# EAGLE board MAIN_BQ_INDUCTOR_REV (EAGLE 9.6.2), part 1 of 2
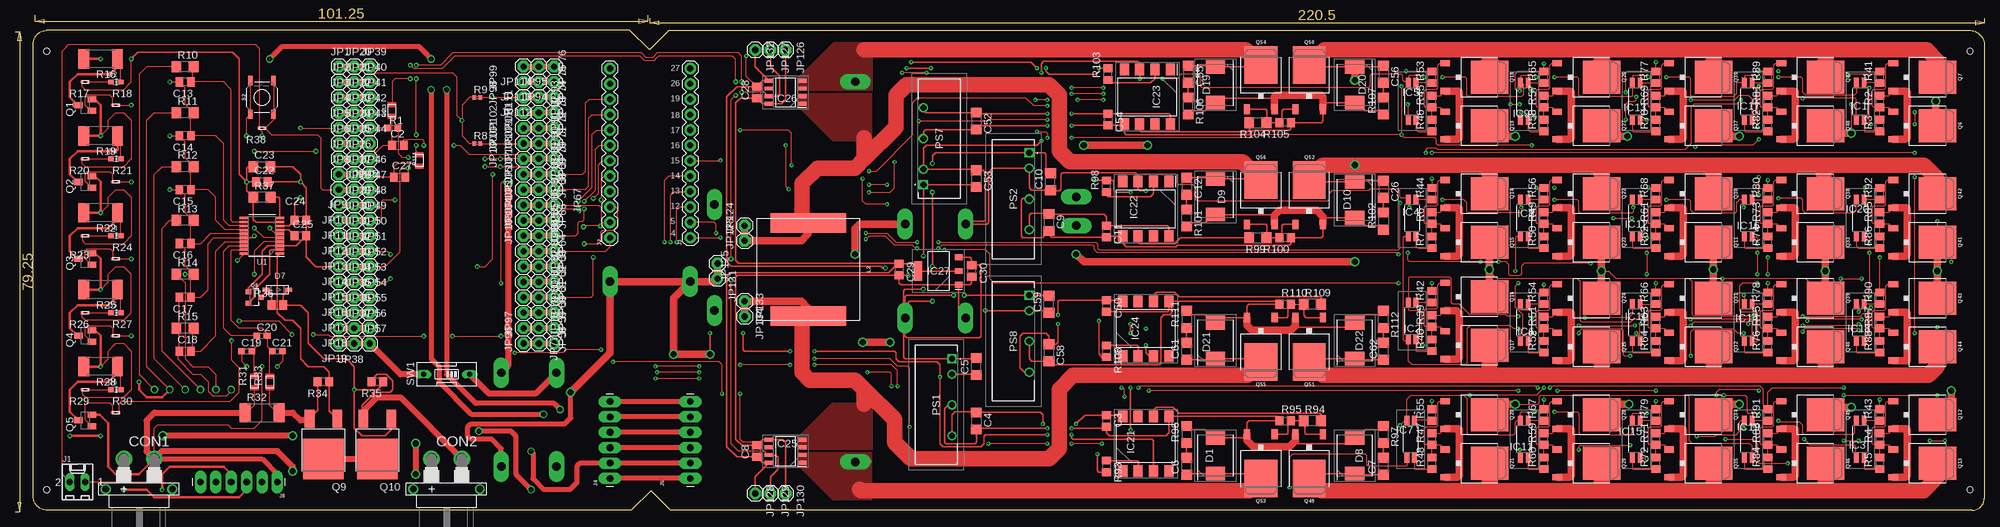
[diagram p2: board, top side]
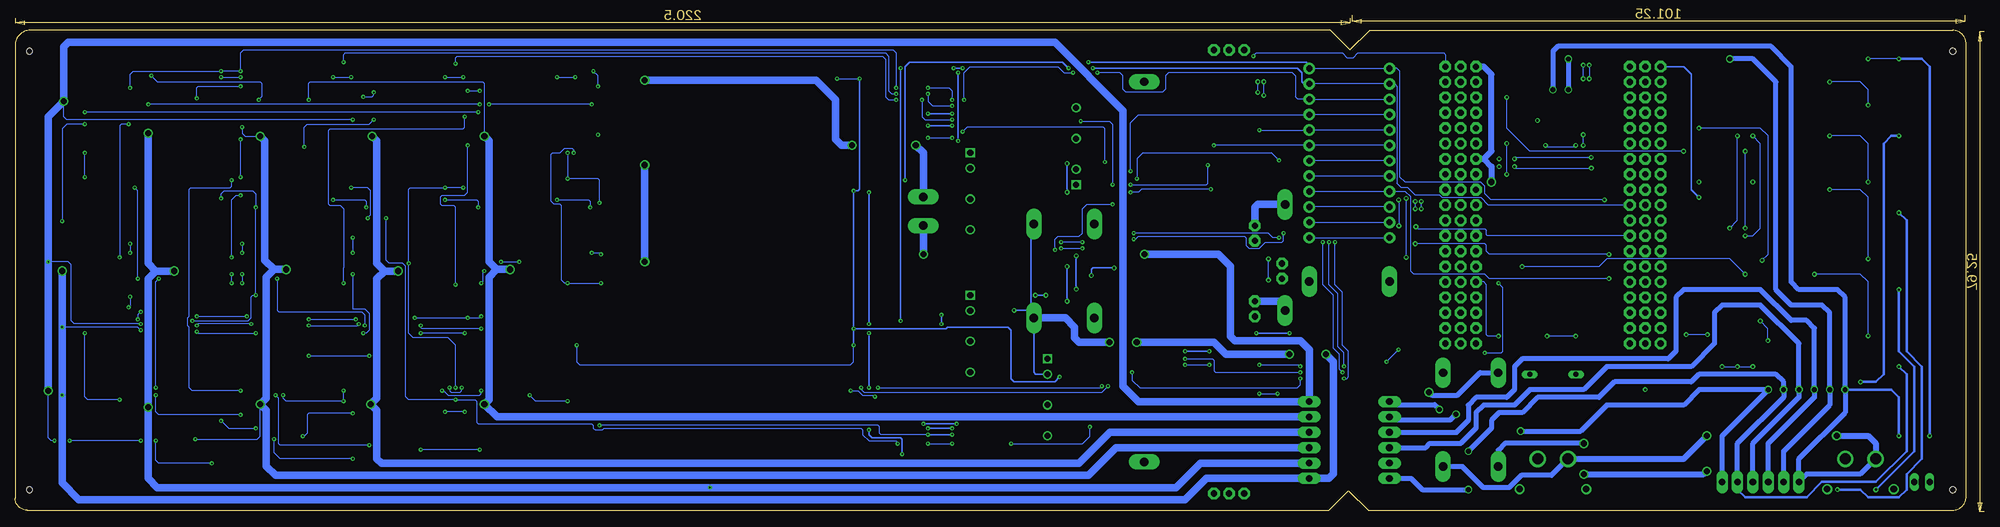
[diagram p3: board, bottom side, seen from below]

Size 322.25 x 79.25 mm. Coordinates in mm from the lower left corner, seen from the top.
Outline: 320.25,0 105.25,0 102,3.25 98.75,0 2.25,0 arc-90 0,2.25 0,77 arc-90 2.25,79.25 98.5,79.25 101.75,76 105,79.25 319.75,79.25 arc-84 322.25,77 322.25,2 arc-90 320.25,0
Copper layers (1*16): Top 0.035mm / dielectric 1.5mm / Bottom 0.035mm
Design rules "default *": minimum track width 6mil, minimum drill 0.25mm, track to track 6mil, track to pad 6mil, pad to pad 6mil, via to via 6mil, smd to smd 6mil, copper to edge 40mil, drill to drill 6mil, minimum pad ring 10mil, minimum via ring 8mil, stop-mask expansion 4mil, vias tented up to drill 0mil, thermal gap 10mil
Holes 1 mm at 319.87,75.79 319.87,3.4 2.22,3.4 2.22,75.79

## Footprints (pad centres in the part's own frame; a part is rotated, then mirrored left to right if it is on the bottom)
C0805 = smd 1.3 x 1.5: 1 -0.95,0; 2 0.95,0
C1206 = smd 1.6 x 1.8: 1 -1.4,0; 2 1.4,0
C0603 = smd 1.1 x 1: 1 -0.85,0; 2 0.85,0
XT30PW-F = drill 1.8: + 2.5,0; - -2.5,0 | drill 1.1: P$3 -5.5,5; P$4 5.5,5
DIOM6959X262N = smd 2.25 x 3.15: 1 -2.95,0; 2 2.95,0
LED_CHIP-LED0603MP = smd 0.8 x 0.9: A 0,-0.794; C 0,0.794
SOD-123 = smd 1.2 x 0.7: A 1.85,0; C -1.85,0
LTV217G = smd 0.8 x 1.5: 1 -0.635,-3.125; 2 0.635,-3.125; 3 0.635,3.125; 4 -0.635,3.125
SOP254P1000X400-8N = smd 1.9 x 1.5: 1 -4.5,3.81; 2 -4.5,1.27; 3 -4.5,-1.27; 4 -4.5,-3.81; 5 4.5,-3.81; 6 4.5,-1.27; 7 4.5,1.27; 8 4.5,3.81
SOIC127P600X175-8N = smd 1.528 x 0.65: 1 -2.711,1.905; 2 -2.711,0.635; 3 -2.711,-0.635; 4 -2.711,-1.905; 5 2.711,-1.905; 6 2.711,-0.635; 7 2.711,0.635; 8 2.711,1.905
SOT229P700X180-4N = smd 1.3 x 0.95: 1 -3.35,2.29; 2 -3.35,0; 3 -3.35,-2.29 | smd 1.3 x 3.25: 4 3.35,0
6410-02 = drill 1.016 long: 1 1.27,0; 2 -1.27,0
1X12 = drill 1.016 pad 1.88: 1 0,0; 2 2.54,0; 3 5.08,0; 4 7.62,0; 5 10.16,0; 6 12.7,0; 7 15.24,0; 8 17.78,0; 9 20.32,0; 10 22.86,0; 11 25.4,0; 12 27.94,0
1X06_LONGPADS = drill 1.118 pad 1.88 long: 1 0,0; 2 2.54,0; 3 5.08,0; 4 7.62,0; 5 10.16,0; 6 12.7,0
1X01 = drill 1.016 pad 1.93 octagon: 1 0,0
1X1-BIGPOGO = drill 1.4 pad 2.54 long: P$1 0,0
PA4344-17X17 = smd 12.5 x 3.15: 1 0,7.675; 2 0,-7.675
B1212S2WR3 = drill 1 pad 1.5 square: 1 0,0 | drill 1 pad 1.5: 2 2.54,0; 4 7.62,0; 6 12.7,0
SOT23 = smd 1 x 1.4: 1 -0.95,-1.1; 2 0.95,-1.1; 3 0,1.1
TO252 = smd 5.4 x 6.2: D 0,2.5 | smd 1 x 1.6: G -2.28,-4.8; S 2.28,-4.8
SOT23-3 = smd 0.8 x 0.9: 1 -0.95,-1; 2 0.95,-1; 3 0,1.1
DPAK = smd 1.6 x 3: 1 -2.3,-6.65; 3 2.3,-6.65 | smd 6.7 x 6.7: 2 0,0
R0603 = smd 1 x 1.1: 1 -0.85,0; 2 0.85,0
R0805 = smd 1.3 x 1.5: 1 -0.95,0; 2 0.95,0
R0402 = smd 0.6 x 0.7: 1 -0.5,0; 2 0.5,0
R1206 = smd 1.6 x 1.803: 1 -1.422,0; 2 1.422,0
R2512 = smd 1.8 x 3.2: 1 -2.8,0; 2 2.8,0
R0402' = smd 0.2 x 0.2: 1 -0.5,0; 2 0.5,0
R0805' = smd 0.2 x 0.2: 1 -1,0; 2 1,0
TACTILE_SWITCH_SMD_5.2MM = smd 1.524 x 0.762: 1 -2.794,1.905; 2 2.794,1.905; 3 -2.794,-1.905; 4 2.794,-1.905
EDG-01 = drill 0.813 long: 1 0,-3.81; 2 0,3.81
TSSOP-20_4.4X6.5MM_PITCH0.65MM = smd 1.45 x 0.45: 1 -2.95,2.925; 2 -2.95,2.275; 3 -2.95,1.625; 4 -2.95,0.975; 5 -2.95,0.325; 6 -2.95,-0.325; 7 -2.95,-0.975; 8 -2.95,-1.625; 9 -2.95,-2.275; 10 -2.95,-2.925; 11 2.95,-2.925; 12 2.95,-2.275; 13 2.95,-1.625; 14 2.95,-0.975; 15 2.95,-0.325; 16 2.95,0.325; 17 2.95,0.975; 18 2.95,1.625; 19 2.95,2.275; 20 2.95,2.925

## Placement (x,y rotation side)
C2  1n  [C0805]  60.25,60.25 0 top
C3  100nF  [C0805]  177.25,14.75 270 top
C4  1uF  [C1206]  155.75,14.75 270 top
C5  4.7uF  [C1206]  155.75,23.75 90 top
C6  EMPTY  [C1206]  190.5,7.25 90 top
C7  EMPTY  [C1206]  223,7.25 90 top
C8  100n  [C0805]  119.5,9.75 90 top
C9  1uF  [C1206]  167.75,47.5 270 top
C10  4.7uF  [C1206]  168,54.25 90 top
C11  100nF  [C0805]  177.25,46 270 top
C12  EMPTY  [C1206]  190.5,53.5 270 top
C13  16V, 1uF  [C0805]  25.08,70.71 180 top
C14  16V, 1uF  [C0805]  25.08,61.82 180 top
C15  16V, 1uF  [C0805]  25.08,52.93 180 top
C16  16V, 1uF  [C0805]  25.08,44.04 180 top
C17  16V, 1uF  [C0805]  25.08,35.15 180 top
C18  16V, 1uF  [C0805]  25.08,26.26 0 top
C19  50V, 0.1uF  [C0603]  35.24,26.26 0 top
C20  50V, 0.1uF  [C0603]  37.78,28.8 0 top
C21  50V, 0.1uF  [C0603]  40.32,26.26 0 top
C22  1uF  [C0805]  37.78,54.2 0 top
C23  10uF  [C1206]  37.78,56.74 0 top
C24  4.7uF  [C0805]  44.13,47.85 0 top
C25  1uF  [C0805]  44.13,45.31 0 top
C26  EMPTY  [C1206]  223,53 270 top
C27  1n  [C0805]  60.5,55 0 top
C28  100n  [C0805]  119.5,69 90 top
C29  22uF  [C0805]  143,39.75 270 top
C30  10uF  [C0805]  155,39.5 270 top
C52  1uF  [C1206]  155.75,64.25 270 top
C53  4.7uF  [C1206]  155.75,54.75 270 top
C54  100nF  [C0805]  177.5,64.5 270 top
C55  EMPTY  [C1206]  190.75,72 270 top
C56  EMPTY  [C1206]  223,72 270 top
C58  1uF  [C1206]  167.75,26 270 top
C59  4.7uF  [C1206]  167.75,34 90 top
C60  100nF  [C0805]  177.25,33.75 270 top
C61  EMPTY  [C1206]  190.5,26.25 90 top
C62  EMPTY  [C1206]  223,26.25 90 top
CON1  XT30PW-F  [XT30PW-F]  17.46,8.48 180 top
CON2  XT30PW-F  [XT30PW-F]  68.26,8.48 180 top
D1  SS34  [DIOM6959X262N]  195.25,9 90 top
D2  KT-0603R  [LED_CHIP-LED0603MP]  13.65,70.71 270 top
D3  KT-0603R  [LED_CHIP-LED0603MP]  13.65,58.01 270 top
D4  KT-0603R  [LED_CHIP-LED0603MP]  13.65,45.31 270 top
D5  KT-0603R  [LED_CHIP-LED0603MP]  13.65,32.61 270 top
D6  KT-0603R  [LED_CHIP-LED0603MP]  13.65,19.91 270 top
D7  1N4148W  [SOD-123]  40.32,36.42 180 top
D8  SS34  [DIOM6959X262N]  218.25,9 90 top
D9  SS34  [DIOM6959X262N]  195.25,51.75 270 top
D10  SS34  [DIOM6959X262N]  218.25,51.25 270 top
D19  SS34  [DIOM6959X262N]  195.25,70.25 270 top
D20  SS34  [DIOM6959X262N]  218.25,70.25 270 top
D21  SS34  [DIOM6959X262N]  195.25,28 90 top
D22  SS34  [DIOM6959X262N]  218.25,28 90 top
IC1  LTV-217-G  [LTV217G]  301.75,67.5 180 top
IC2  LTV-217-G  [LTV217G]  227.75,31.25 180 top
IC3  LTV-217-G  [LTV217G]  301.75,11.75 180 top
IC4  LTV-217-G  [LTV217G]  227.75,48.25 180 top
IC5  LTV-217-G  [LTV217G]  227.75,67.5 180 top
IC6  LTV-217-G  [LTV217G]  246.25,31 180 top
IC7  LTV-217-G  [LTV217G]  227.5,11.75 180 top
IC8  LTV-217-G  [LTV217G]  246.25,48.25 180 top
IC9  LTV-217-G  [LTV217G]  246.25,67.5 180 top
IC10  LTV-217-G  [LTV217G]  264.75,31 180 top
IC11  LTV-217-G  [LTV217G]  246.25,11.75 180 top
IC12  LTV-217-G  [LTV217G]  264.75,48.25 180 top
IC13  LTV-217-G  [LTV217G]  264.75,67.5 180 top
IC14  LTV-217-G  [LTV217G]  283.25,31 180 top
IC15  LTV-217-G  [LTV217G]  264.75,11.75 180 top
IC16  LTV-217-G  [LTV217G]  283.25,48.25 180 top
IC17  LTV-217-G  [LTV217G]  283.25,67.5 180 top
IC18  LTV-217-G  [LTV217G]  301.75,31 180 top
IC19  LTV-217-G  [LTV217G]  283.25,11.75 180 top
IC20  LTV-217-G  [LTV217G]  301.75,48.25 180 top
IC21  FOD3182SD  [SOP254P1000X400-8N]  183.75,11 90 top
IC22  FOD3182SD  [SOP254P1000X400-8N]  183.75,49.75 270 top
IC23  FOD3182SD  [SOP254P1000X400-8N]  184,68.25 270 top
IC24  FOD3182SD  [SOP254P1000X400-8N]  183.75,30 90 top
IC25  TMCS1101A4BQDT  [SOIC127P600X175-8N]  124.25,9.75 180 top
IC26  TMCS1101A4BQDT  [SOIC127P600X175-8N]  124.25,69 180 top
IC27  AMS1117  [SOT229P700X180-4N]  149.5,39.5 180 top
J1  22-27-2021-02  [6410-02]  7.3,4.67 0 top
J2  [1X12]  95.25,45 90 top
J3  [1X12]  108.5,45 90 top
J4  [1X06_LONGPADS]  95.25,5.25 90 top
J5  [1X06_LONGPADS]  108.5,5.25 90 top
J8  [1X06_LONGPADS]  40.32,4.67 180 top
JP1  [1X01]  50.48,73.25 0 top
JP2  [1X01]  50.48,70.71 0 top
JP3  [1X01]  50.48,68.17 0 top
JP4  [1X01]  50.48,65.63 0 top
JP5  [1X01]  50.48,63.09 0 top
JP6  [1X01]  50.48,60.55 0 top
JP7  [1X01]  50.48,58.01 0 top
JP8  [1X01]  50.48,55.47 0 top
JP9  [1X01]  50.48,52.93 180 top
JP10  [1X01]  50.48,50.39 180 top
JP11  [1X01]  50.48,47.85 180 top
JP12  [1X01]  50.48,45.31 180 top
JP13  [1X01]  50.48,42.77 180 top
JP14  [1X01]  50.48,40.23 180 top
JP15  [1X01]  50.48,37.69 180 top
JP16  [1X01]  50.48,35.15 180 top
JP17  [1X01]  50.48,32.61 180 top
JP18  [1X01]  50.48,30.07 180 top
JP19  [1X01]  50.48,27.53 180 top
JP20  [1X01]  53.02,73.25 0 top
JP21  [1X01]  53.02,70.71 0 top
JP22  [1X01]  53.02,68.17 0 top
JP23  [1X01]  53.02,65.63 0 top
JP24  [1X01]  53.02,63.09 0 top
JP25  [1X01]  53.02,60.55 0 top
JP26  [1X01]  53.02,58.01 0 top
JP27  [1X01]  53.02,55.47 0 top
JP28  [1X01]  53.02,52.93 0 top
JP29  [1X01]  53.02,50.39 0 top
JP30  [1X01]  53.02,47.85 0 top
JP31  [1X01]  53.02,45.31 0 top
JP32  [1X01]  53.02,42.77 0 top
JP33  [1X01]  53.02,40.23 0 top
JP34  [1X01]  53.02,37.69 0 top
JP35  [1X01]  53.02,35.15 0 top
JP36  [1X01]  53.02,32.61 0 top
JP37  [1X01]  53.02,30.07 0 top
JP38  [1X01]  53.02,27.53 180 top
JP39  [1X01]  55.56,73.25 0 top
JP40  [1X01]  55.56,70.71 0 top
JP41  [1X01]  55.56,68.17 0 top
JP42  [1X01]  55.56,65.63 0 top
JP43  [1X01]  55.56,63.09 0 top
JP44  [1X01]  55.56,60.55 0 top
JP45  [1X01]  55.56,58.01 180 top
JP46  [1X01]  55.56,55.47 0 top
JP47  [1X01]  55.56,52.93 0 top
JP48  [1X01]  55.56,50.39 0 top
JP49  [1X01]  55.56,47.85 0 top
JP50  [1X01]  55.56,45.31 0 top
JP51  [1X01]  55.56,42.77 0 top
JP52  [1X01]  55.56,40.23 0 top
JP53  [1X01]  55.56,37.69 0 top
JP54  [1X01]  55.56,35.15 0 top
JP55  [1X01]  55.56,32.61 0 top
JP56  [1X01]  55.56,30.07 0 top
JP57  [1X01]  55.56,27.53 0 top
JP58  [1X01]  86.04,27.53 90 top
JP59  [1X01]  86.04,30.07 90 top
JP60  [1X01]  86.04,32.61 90 top
JP61  [1X01]  86.04,35.15 90 top
JP62  [1X01]  86.04,37.69 90 top
JP63  [1X01]  86.04,40.23 90 top
JP64  [1X01]  86.04,42.77 90 top
JP65  [1X01]  86.04,45.31 90 top
JP66  [1X01]  86.04,47.85 90 top
JP67  [1X01]  86.04,50.39 90 top
JP68  [1X01]  86.04,52.93 90 top
JP69  [1X01]  86.04,55.47 90 top
JP70  [1X01]  86.04,58.01 90 top
JP71  [1X01]  86.04,60.55 90 top
JP72  [1X01]  86.04,63.09 90 top
JP73  [1X01]  86.04,65.63 90 top
JP74  [1X01]  86.04,68.17 90 top
JP75  [1X01]  86.04,70.71 90 top
JP76  [1X01]  86.04,73.25 90 top
JP77  [1X01]  83.5,27.53 270 top
JP78  [1X01]  83.5,30.07 90 top
JP79  [1X01]  83.5,32.61 90 top
JP80  [1X01]  83.5,35.15 90 top
JP81  [1X01]  83.5,37.69 90 top
JP82  [1X01]  83.5,40.23 90 top
JP83  [1X01]  83.5,42.77 90 top
JP84  [1X01]  83.5,45.31 90 top
JP85  [1X01]  83.5,47.85 90 top
JP86  [1X01]  83.5,50.39 90 top
JP87  [1X01]  83.5,52.93 90 top
JP88  [1X01]  83.5,55.47 90 top
JP89  [1X01]  83.5,58.01 90 top
JP90  [1X01]  83.5,60.55 90 top
JP91  [1X01]  83.5,63.09 90 top
JP92  [1X01]  83.5,65.63 90 top
JP93  [1X01]  83.5,68.17 90 top
JP94  [1X01]  83.5,70.71 180 top
JP95  [1X01]  83.5,73.25 180 top
JP96  [1X01]  80.96,27.53 90 top
JP97  [1X01]  80.96,30.07 90 top
JP98  [1X01]  80.96,32.61 90 top
JP99  [1X01]  80.96,35.15 90 top
JP100  [1X01]  80.96,37.69 90 top
JP101  [1X01]  80.96,40.23 90 top
JP102  [1X01]  80.96,42.77 90 top
JP103  [1X01]  80.96,45.31 90 top
JP104  [1X01]  80.96,47.85 90 top
JP105  [1X01]  80.96,50.39 90 top
JP106  [1X01]  80.96,52.93 90 top
JP107  [1X01]  80.96,55.47 90 top
JP108  [1X01]  80.96,58.01 90 top
JP109  [1X01]  80.96,60.55 90 top
JP110  [1X01]  80.96,63.09 90 top
JP111  [1X01]  80.96,65.63 90 top
JP112  [1X01]  80.96,68.17 180 top
JP113  [1X01]  80.96,70.71 180 top
JP114  [1X01]  80.96,73.25 180 top
JP115  [1X1-BIGPOGO]  144,47.25 90 top
JP116  [1X1-BIGPOGO]  154,31.75 270 top
JP117  [1X1-BIGPOGO]  144,31.75 270 top
JP118  [1X1-BIGPOGO]  154,47.25 270 top
JP119  [1X1-BIGPOGO]  86.4,7.21 270 top
JP120  [1X1-BIGPOGO]  77.31,22.7 90 top
JP121  [1X1-BIGPOGO]  86.4,22.7 90 top
JP122  [1X1-BIGPOGO]  77.31,7.21 90 top
JP123  [1X01]  117.5,44.5 90 top
JP124  [1X01]  117.5,47 90 top
JP125  [1X01]  113,40.75 270 top
JP126  [1X01]  124.25,76 270 top
JP127  [1X01]  121.75,76 270 top
JP128  [1X01]  119.25,2.75 270 top
JP129  [1X01]  121.75,2.75 270 top
JP130  [1X01]  124.25,2.75 270 top
JP131  [1X01]  113,38.25 270 top
JP132  [1X01]  119.25,76 270 top
JP133  [1X01]  117.5,34.5 270 top
JP134  [1X01]  117.5,32 270 top
JP135  [1X1-BIGPOGO]  95.25,37.75 270 top
JP136  [1X1-BIGPOGO]  108.5,37.75 90 top
JP137  [1X1-BIGPOGO]  135.75,8 0 top
JP138  [1X1-BIGPOGO]  112.5,33 90 top
JP139  [1X1-BIGPOGO]  112.5,50.5 270 top
JP140  [1X1-BIGPOGO]  135.75,70.75 180 top
JP141  [1X1-BIGPOGO]  172.25,47 0 top
JP142  [1X1-BIGPOGO]  172.25,51.75 0 bottom
L2  SMMS1770-470M  [PA4344-17X17]  128,39.75 180 top
PS1  B0515S-2WR3  [B1212S2WR3]  151.75,25 270 top
PS2  B0515S-2WR3  [B1212S2WR3]  164.5,59 270 top
PS7  B0515S-2WR3  [B1212S2WR3]  147,53.75 90 top
PS8  B0515S-2WR3  [B1212S2WR3]  164.5,35.5 270 top
Q1  AO3400A  [SOT23]  8.57,66.9 90 top
Q2  AO3400A  [SOT23]  8.57,54.2 90 top
Q3  AO3400A  [SOT23]  8.57,41.5 90 top
Q4  AO3400A  [SOT23]  8.57,28.8 90 top
Q5  AO3400A  [SOT23]  8.57,14.83 90 top
Q6  HSU4119  [TO252]  312,63.5 270 top
Q7  HSU4119  [TO252]  312,71.5 270 top
Q8  20V/4.2A/52mΩ/1.4W  [SOT23-3]  36.51,35.15 270 top
Q9  DOD120N04  [DPAK]  47.94,8.48 180 top
Q10  DOD120N04  [DPAK]  56.83,8.48 180 top
Q11  DOD120N04  [TO252]  275,44.25 270 top
Q12  HSU4119  [TO252]  312,15.75 270 top
Q13  HSU4119  [TO252]  312,7.75 270 top
Q14  HSU4119  [TO252]  238,52.25 270 top
Q15  HSU4119  [TO252]  238,44.25 270 top
Q16  HSU4119  [TO252]  238,35.25 270 top
Q17  HSU4119  [TO252]  238,27.25 270 top
Q18  HSU4119  [TO252]  238,71.5 270 top
Q19  HSU4119  [TO252]  238,63.5 270 top
Q20  HSU4119  [TO252]  238,15.75 270 top
Q21  HSU4119  [TO252]  238,7.75 270 top
Q22  HSU4119  [TO252]  256.5,52.25 270 top
Q23  HSU4119  [TO252]  256.5,44.25 270 top
Q24  HSU4119  [TO252]  256.5,35 270 top
Q25  HSU4119  [TO252]  256.5,27 270 top
Q26  HSU4119  [TO252]  256.5,71.5 270 top
Q27  HSU4119  [TO252]  256.5,63.5 270 top
Q28  HSU4119  [TO252]  256.5,15.75 270 top
Q29  HSU4119  [TO252]  256.5,7.75 270 top
Q30  DOD120N04  [TO252]  275,52.25 270 top
Q31  DOD120N04  [TO252]  275,35 270 top
Q32  DOD120N04  [TO252]  275,27 270 top
Q33  DOD120N04  [TO252]  293.5,44.25 270 top
Q34  DOD120N04  [TO252]  275,15.75 270 top
Q35  DOD120N04  [TO252]  275,7.75 270 top
Q36  DOD120N04  [TO252]  275,71.5 270 top
Q37  DOD120N04  [TO252]  275,63.5 270 top
Q38  DOD120N04  [TO252]  293.5,52.25 270 top
Q39  DOD120N04  [TO252]  293.5,35 270 top
Q40  DOD120N04  [TO252]  293.5,27 270 top
Q41  DOD120N04  [TO252]  312,44.25 270 top
Q42  DOD120N04  [TO252]  312,52.25 270 top
Q43  DOD120N04  [TO252]  312,35 270 top
Q44  DOD120N04  [TO252]  312,27 270 top
Q45  DOD120N04  [TO252]  293.5,15.75 270 top
Q46  DOD120N04  [TO252]  293.5,7.75 270 top
Q47  DOD120N04  [TO252]  293.5,71.5 270 top
Q48  DOD120N04  [TO252]  293.5,63.5 270 top
Q49  DOD120N04  [TO252]  210.75,7.75 180 top
Q50  DOD120N04  [TO252]  210.75,71 0 top
Q51  DOD120N04  [TO252]  210.75,27 180 top
Q52  DOD120N04  [TO252]  210.75,52 0 top
Q53  DOD120N04  [TO252]  202.75,7.75 180 top
Q54  DOD120N04  [TO252]  202.75,71 0 top
Q55  DOD120N04  [TO252]  202.75,27 180 top
Q56  DOD120N04  [TO252]  202.75,52 0 top
R1  510k  [R0603]  59.37,63.09 0 top
R2  10k  [R0805]  305,67.5 90 top
R3  470  [R0805]  305,63.5 90 top
R4  10k  [R0805]  305,11.75 90 top
R5  470  [R0805]  305,7.75 90 top
R6  10k  [R0805]  231,48.25 90 top
R7  470  [R0805]  231,44.25 90 top
R8  4.7k  [R0402]  73.34,60.55 0 top
R9  4.7k  [R0402]  73.34,68.17 0 top
R10  100  [R1206]  25.08,73.25 0 top
R11  100  [R1206]  25.08,65.63 0 top
R12  100  [R1206]  25.08,56.74 0 top
R13  100  [R1206]  25.08,47.85 0 top
R14  100  [R1206]  25.08,38.96 0 top
R15  100  [R1206]  25.08,30.07 0 top
R16  15R, 1W  [R2512]  11.11,74.52 180 top
R17  1k  [R0402']  8.57,70.71 180 top
R18  10k  [R0402']  13.65,66.9 0 top
R19  15R, 1W  [R2512]  11.11,61.82 180 top
R20  1k  [R0402']  8.57,58.01 180 top
R21  10k  [R0402']  13.65,54.2 0 top
R22  15R, 1W  [R2512]  11.11,49.12 180 top
R23  1k  [R0402']  8.57,45.31 180 top
R24  10k  [R0402']  13.65,41.5 0 top
R25  15R, 1W  [R2512]  11.11,36.42 180 top
R26  1k  [R0402']  8.57,32.61 180 top
R27  10k  [R0402']  13.65,28.8 0 top
R28  15R, 1W  [R2512]  11.11,23.72 180 top
R29  1k  [R0402']  8.57,19.91 180 top
R30  10k  [R0402']  13.65,16.1 0 top
R31  100  [R0805']  36.51,21.18 90 top
R32  WSL25121L000FEA18  [R2512]  37.78,16.1 0 top
R33  100  [R0805']  39.05,21.18 90 top
R34  1M  [R0805]  47.94,21.18 180 top
R35  1M  [R0805]  56.83,21.18 180 top
R36  1M  [R0805]  40.32,33.88 0 top
R37  100  [R1206]  37.78,51.66 0 top
R38  10k  [R0402']  37.78,63.09 180 top
R39  10k  [R0805]  231,31.25 90 top
R40  470  [R0805]  231,27.25 90 top
R41  220  [R0805]  305,71.5 90 top
R42  220  [R0805]  231,35.25 90 top
R43  220  [R0805]  305,15.75 90 top
R44  220  [R0805]  231,52.25 90 top
R45  10k  [R0805]  231,67.5 90 top
R46  470  [R0805]  231,63.5 90 top
R47  10k  [R0805]  231,11.75 90 top
R48  470  [R0805]  231,7.75 90 top
R49  10k  [R0805]  249.5,48.25 90 top
R50  470  [R0805]  249.5,44.25 90 top
R51  10k  [R0805]  249.5,31 90 top
R52  470  [R0805]  249.5,27 90 top
R53  220  [R0805]  231,71.5 90 top
R54  220  [R0805]  249.5,35 90 top
R55  220  [R0805]  231,15.75 90 top
R56  220  [R0805]  249.5,52.25 90 top
R57  10k  [R0805]  249.5,67.5 90 top
R58  470  [R0805]  249.5,63.5 90 top
R59  10k  [R0805]  249.5,11.75 90 top
R60  470  [R0805]  249.5,7.75 90 top
R61  10k  [R0805]  268,48.25 90 top
R62  470  [R0805]  268,44.25 90 top
R63  10k  [R0805]  268,31 90 top
R64  470  [R0805]  268,27 90 top
R65  220  [R0805]  249.5,71.5 90 top
R66  220  [R0805]  268,35 90 top
R67  220  [R0805]  249.5,15.75 90 top
R68  220  [R0805]  268,52.25 90 top
R69  10k  [R0805]  268,67.5 90 top
R70  470  [R0805]  268,63.5 90 top
R71  10k  [R0805]  268,11.75 90 top
R72  470  [R0805]  268,7.75 90 top
R73  10k  [R0805]  286.5,48.25 90 top
R74  470  [R0805]  286.5,44.25 90 top
R75  10k  [R0805]  286.5,31 90 top
R76  470  [R0805]  286.5,27 90 top
R77  220  [R0805]  268,71.5 90 top
R78  220  [R0805]  286.5,35 90 top
R79  220  [R0805]  268,15.75 90 top
R80  220  [R0805]  286.5,52.25 90 top
R81  10k  [R0805]  286.5,67.5 90 top
R82  470  [R0805]  286.5,63.5 90 top
R83  10k  [R0805]  286.5,11.75 90 top
R84  470  [R0805]  286.5,7.75 90 top
R85  10k  [R0805]  305,48.25 90 top
R86  470  [R0805]  305,44.25 90 top
R87  10k  [R0805]  305,31 90 top
R88  470  [R0805]  305,27 90 top
R89  220  [R0805]  286.5,71.5 90 top
R90  220  [R0805]  305,35 90 top
R91  220  [R0805]  286.5,15.75 90 top
R92  220  [R0805]  305,52.25 90 top
R93  200  [R0805]  177.25,7.25 270 top
R94  10  [R1206]  211.25,14.75 0 top
R95  10k  [R0805]  206.75,14.75 0 top
R96  EMPTY  [R1206]  190.5,12.5 90 top
R97  EMPTY  [R1206]  223,12.5 270 top
R98  200  [R0805]  177.25,53.5 90 top
R99  10  [R1206]  202.25,45 180 top
R100  10k  [R0805]  206.75,45 180 top
R101  EMPTY  [R1206]  190.5,48.25 270 top
R102  EMPTY  [R1206]  223,47.75 90 top
R103  200  [R0805]  177.5,72 90 top
R104  10  [R1206]  202.25,64 180 top
R105  10k  [R0805]  206.75,64 180 top
R106  EMPTY  [R1206]  190.75,66.75 270 top
R107  EMPTY  [R1206]  223,66.75 90 top
R108  200  [R0805]  177.25,26.25 270 top
R109  10  [R1206]  211.25,34 0 top
R110  10k  [R0805]  206.75,34 0 top
R111  EMPTY  [R1206]  190.5,31.5 90 top
R112  EMPTY  [R1206]  223,31.5 270 top
R113  220  [R0805']  59.25,66 90 top
R114  220  [R0805']  63.75,57.75 270 top
S2  MOMENTARY-SWITCH-SPST-SMD-5.2-TALL-REDUNDANT  [TACTILE_SWITCH_SMD_5.2MM]  37.78,68.17 90 top
SW1  [EDG-01]  68.26,22.45 90 top
U1  BQ76920  [TSSOP-20_4.4X6.5MM_PITCH0.65MM]  37.78,45.31 180 top

## Tracks (layer width: path | path; a pad name or v marks a point on that pad's centre or on a via)
3.3V  (via drill 0.35)
  Top 0.152: R8.1 72.07,60.55 70.8,61.82 v70.8,64.36 | R9.1 72.07,68.17 70.8,66.9 v70.8,64.36 | v70.8,64.36 70.03,65.13 70.03,71.48 69.26,72.25 56.56,72.25 JP39.1
  Top 0.254: U1.8 42.27,46.94 C24.1 43.18,50.71 v44.13,51.66
  Top 1.016: JP1.1 JP20.1 JP39.1
  Bottom 0.254: v44.13,51.66 45.4,52.93 45.4,71.98 46.67,73.25 JP1.1
5V
  Top 1.016: JP121.P$1 82.95,19.25 75.27,19.25 SW1.1
B1  (via drill 0.25, 0.35, 0.8, 1)
  Top 0.152: R14.1 25.08,37.54 25.08,24.99 26.35,23.72 28.89,23.72 30.16,22.45 v30.16,19.91 | v11.11,23.72 12.38,24.99 12.38,26.26 13.65,27.53 14.92,27.53 16.19,26.26 16.19,19.91 14.92,18.64 8.57,18.64 8.07,19.14 R29.2 | v207.5,3.75 207.5,8.75 208,9.25 220,9.25 220.25,9 220.25,7.5 220.5,7.25 226.75,7.25 226.87,7.36 IC7.3 | Q39.D 292.75,38.25 v279,38.25 | v245.25,30 244.5,30 244,30.5 237.25,30.5 236.75,30 236.75,24.25 236.5,24 227.75,24 227.12,24.64 227.12,28 | 227.12,28 IC2.3 | IC4.3 226.38,45.12 226.25,45 226.25,28.25 226.5,28 227.12,28 | v255.25,30.5 v264.5,30.5 | IC5.3 227.12,66.88 v227,67 | v244,67 v245.5,67 | v300.25,67 v300.25,62.25
  Top 0.406: Q4.2 10.16,29.75 11.11,28.8 v11.11,23.72 R28.2
  Top 0.813: v82.23,9.75 82.52,9.46 82.52,5.17 84.29,3.4 88.58,3.4 89.75,4.57 89.75,7.25 90.25,7.75 95.21,7.75 J4.2 J5.2
  Top 1.27: Q39.D v296,39.5 Q33.D | Q48.D 296,64.25 298,62.25 v300.25,62.25 | Q45.D 297.25,17 v300.25,17
  Bottom 0.152: v279,38.25 279,33 278.75,32.75 265,32.75 264.5,32.25 v264.5,30.5 | v245.25,30 255,30 255.25,30.25 v255.25,30.5 | v227,67 v244,67 | v245.5,67 v300.25,67
  Bottom 0.406: J8.2 37.78,3.4 36.51,2.13 26.35,2.13 23.81,4.67 14.92,4.67 9.84,9.75 9.84,22.45 v11.11,23.72
  Bottom 0.813: J8.2 37.78,11.02 30.16,18.64 v30.16,19.91 30.16,21.18 31.43,22.45 44.13,22.45 45.4,21.18 58.1,21.18 60.64,18.64 70.8,18.64 73.34,16.1 77.15,16.1 78.42,14.83 78.42,13.56 v82.23,9.75
  Bottom 1.27: J5.2 126.5,7.79 130.54,3.75 v207.5,3.75 298.75,3.75 300.25,5.25 v300.25,17 300.25,38.25 299,39.5 | v300.25,62.25 300.25,40.75 299,39.5 | v296,39.5 299,39.5
B2  (via drill 0.25, 0.35, 0.4, 0.8, 1)
  Top 0.152: v27.62,19.91 21.27,26.26 21.27,46.58 22.54,47.85 R13.1 | R26.2 8.04,32.49 8.04,31.87 8.57,31.34 14.92,31.34 16.19,32.61 16.19,38.96 14.92,40.23 13.65,40.23 12.38,38.96 12.38,37.69 v11.11,36.42 | IC3.3 301,8.74 301,10.5 300.75,10.75 293.5,10.75 v292.5,11.75 | IC1.3 301.12,67.88 301,68 v292.25,68 | v285,70 285,69.75 284.75,69.5 v284.75,63.25
  Top 0.406: R25.2 v11.11,36.42 11.11,41.5 10.16,42.45 Q3.2 | J8.3 35.24,3.4 33.97,2.13 20,2.13 18.73,3.4 v14.92,3.4
  Top 0.813: J5.3 J4.3
  Top 1.27: v281.75,61.75 279,61.75 277.5,63.25 Q37.D | Q11.D v277.5,39.75 Q31.D | Q34.D 279.25,17.5 v281.75,17.5
  Bottom 0.152: v292.5,11.75 282.25,11.75 281.75,12.25 v281.75,17.5 | v292.25,68 292.25,69.75 292,70 v285,70 | v284.75,63.25 284.75,62.25 284.25,61.75 v281.75,61.75
  Bottom 0.406: v14.92,3.4 8.57,9.75 8.57,23.72 11.11,26.26 v11.11,36.42
  Bottom 0.813: J8.3 35.24,11.02 27.62,18.64 v27.62,19.91 27.62,27.53 33.97,33.88 40.32,33.88 41.59,32.61 41.59,27.53 45.4,23.72 59.37,23.72 63.18,19.91 72.07,19.91 74.61,17.37 79.69,17.37 80.96,16.1 80.96,13.56 83.5,11.02 88.58,11.02 89.27,10.33 J4.3
  Bottom 1.27: 279.5,39.75 280.75,38.5 280.75,18.5 v281.75,17.5 280.75,16.5 280.75,7.25 279.25,5.75 145,5.75 140.42,10.33 J5.3 | 279.5,39.75 281,41.25 281,61 v281.75,61.75 | v277.5,39.75 279.5,39.75
B3  (via drill 0.25, 0.35, 0.8, 1)
  Top 0.152: v25.08,19.91 20,24.99 20,55.47 21.27,56.74 R12.1 | R23.2 8.05,45.24 8.05,44.56 8.57,44.04 14.92,44.04 16.19,45.31 16.19,51.66 14.92,52.93 13.65,52.93 12.38,51.66 12.38,50.39 v11.11,49.12 | v292.25,32 301.75,32 302.25,32.5 302.5,32.5 302.63,32.36 302.63,28.12 IC18.4 302.88,27.88 303.25,28.25 303.25,33.25 v303.5,33.5 | v284,32 274.25,32 274,32.25 274,37.75 273.5,38.25 261.5,38.25 260.25,39.5 v259,39.5 | IC20.4 303.12,45.12 303.25,45 v303.25,44 | v303.25,42.5 v303.25,35.25
  Top 0.406: Q2.2 10.16,55.15 11.11,54.2 v11.11,49.12 R22.2 | J8.4 32.7,5.94 31.43,7.21 22.54,7.21 21.27,5.94 v21.27,3.4
  Top 0.813: J5.4 J4.4
  Top 1.27: v263.5,17.5 260.5,17.5 259,16 Q28.D | Q23.D v259,39.5 Q24.D | v263.25,61.75 260.25,61.75 259,63 Q27.D
  Bottom 0.152: v292.25,32 v284,32 | v303.25,44 v303.25,42.5 | v303.25,35.25 303.25,33.75 v303.5,33.5
  Bottom 0.406: v21.27,3.4 17.46,3.4 16.19,2.13 11.11,2.13 9.84,3.4 9.84,5.94 7.3,8.48 7.3,23.72 9.84,26.26 9.84,47.85 v11.11,49.12
  Bottom 0.813: J8.4 32.7,11.02 25.08,18.64 v25.08,19.91 25.08,30.07 26.35,31.34 28.89,31.34 33.97,36.42 46.67,36.42 47.94,35.15 47.94,26.26 49.21,24.99 73.34,24.99 74.61,23.72 74.61,19.91 75.88,18.64 80.96,18.64 82.23,17.37 82.23,14.83 84.19,12.87 J4.4
  Bottom 1.27: 261.25,39.5 262.5,38.25 262.5,18.5 v263.5,17.5 262.5,16.5 262.5,8.5 261.75,7.75 146.5,7.75 141.38,12.87 J5.4 | v259,39.5 261.25,39.5 | 261.25,39.5 262.5,40.75 262.5,61 v263.25,61.75
B4  (via drill 0.25, 0.35, 0.8, 1)
  Top 0.152: v22.54,19.91 18.73,23.72 18.73,64.36 20,65.63 R11.1 | v11.11,61.82 12.38,63.09 12.38,64.36 13.65,65.63 14.92,65.63 16.19,64.36 16.19,58.01 14.92,56.74 8.57,56.74 8.02,57.29 8.02,57.81 R20.2 | IC19.4 283.88,10.61 283.5,11 274,11 273.5,11.5 273.5,18.75 273.25,19 249,19 248.75,18.75 248.75,17.75 248.5,17.5 v244.75,17.5 | v273.75,31.5 283.75,31.5 283.88,31.36 IC14.4 284.01,27.75 284.5,27.75 284.75,28 284.75,32.5 284.5,32.75 282,32.75 281.75,33 281.75,37 282.25,37.5 v284.75,37.5 | v240.5,39.75 240.5,39.5 241.75,38.25 255,38.25 255.5,37.75 255.5,31.25 255.75,31 263.75,31 264.25,31.5 v266,31.5 | IC16.4 284.62,45.12 284.75,45 v284.75,44 | v284.75,42.5 v284.75,39 | IC17.4 283.88,67.87 283.25,68.5 281.75,68.5 281,67.75 v273.75,67.75
  Top 0.406: Q1.2 10.16,67.85 11.11,66.9 v11.11,61.82 R19.2 | v22.54,19.91 21.27,18.64 18.73,18.64 17.46,19.91 v17.46,21.18
  Top 0.813: v39.05,74.52 41.11,76.58 63.66,76.58 v65.72,74.52 | v84.27,15.85 72.32,15.85 66.99,21.18 66.99,23.72 65.72,24.99 v65.72,69.44 | J5.5 J4.5
  Top 1.27: Q20.D 240.25,15.5 240.25,16.5 241.25,17.5 v244.75,17.5 | Q15.D v240.5,39.75 Q16.D | v244.75,61.75 241,61.75 240,62.75 240,64 Q19.D
  Bottom 0.152: v273.75,31.5 v266,31.5 | v284.75,44 v284.75,42.5 | v284.75,39 v284.75,37.5 | v244.75,61.75 244.75,70.5 245,70.75 273.5,70.75 273.75,70.5 v273.75,67.75
  Bottom 0.406: v11.11,61.82 12.38,61.82 13.65,60.55 13.65,22.45 14.92,21.18 v17.46,21.18
  Bottom 0.813: J8.5 30.16,9.75 22.54,17.37 v22.54,19.91 22.54,32.61 23.81,33.88 28.89,33.88 31.43,36.42 31.43,70.71 35.24,74.52 v39.05,74.52 | v65.72,74.52 v65.72,69.44 | J4.5 94.75,14.91 85.21,14.91 v84.27,15.85
  Bottom 1.27: J5.5 242.66,15.41 v244.75,17.5 244,18.25 244,38.5 242.75,39.75 | v240.5,39.75 242.75,39.75 | 242.75,39.75 244,41 244,61 v244.75,61.75
B5  (via drill 0.25, 0.35, 0.8, 1)
  Top 0.152: v20,19.91 17.46,22.45 17.46,71.98 18.73,73.25 R10.1 | R17.2 8.02,70.5 8.02,69.99 8.57,69.44 14.92,69.44 16.19,70.71 v16.19,74.52 | IC15.4 266.38,8.62 v266.5,8.5 | v279.5,11.75 284,11.75 284.75,11 284.75,8 285,7.75 v289.75,7.75 | v299,11.5 v301.5,11.5 | v313.25,11.5 v315.75,11.5 | 265.38,28.61 265.38,30.64 v265.5,30.75 | v283.25,30.75 283,31 274.25,31 v273.75,30.5 | IC12.4 266.38,45.12 v266.5,45 | v266.5,42.5 v266.5,39 | v264.75,29.25 265.38,28.61 | 265.38,28.61 IC10.4 | v301.5,30.75 301.25,30.5 v292.25,30.5 | IC13.4 265.51,64.5 v266.5,64.5
  Top 0.254: v16.19,74.52 17.26,75.59 32.9,75.59 33.97,74.52 33.97,55.47 v35.24,54.2 | C22.1 v35.24,54.2 | C23.1 35.53,56.74 35.24,56.45 v35.24,54.2 | v35.24,54.2 35.24,52.78 R37.1 36.36,48 36.78,47.59 U1.9
  Top 0.406: v11.11,74.52 R16.2 | v6.03,12.29 v11.11,12.29
  Top 0.813: v68.26,69.44 68.26,22.45 73.07,17.64 86.02,17.64 v87.02,16.64 | J5.6 J4.6
  Top 1.016: v42.86,12.29 v21.41,12.29
  Top 1.27: v314.25,67.5 314.25,63.25 Q6.D | v316.75,19.75 316.75,18 Q12.D | JP115.P$1 136.5,47.25 135.75,46.5 v135.75,42.25
  Bottom 0.152: v11.11,74.52 v16.19,74.52 | v266.5,8.5 278.5,8.5 279.5,9.5 v279.5,11.75 | v289.75,7.75 298.5,7.75 299,8.25 v299,11.5 | v316.75,19.75 316.75,12 316.25,11.5 v315.75,11.5 | v301.5,11.5 v313.25,11.5 | v273.75,30.5 265.75,30.5 v265.5,30.75 | v301.5,30.75 312.5,30.75 313,31.25 313,40.5 313.5,41 v316.75,41 | v266.5,45 v266.5,42.5 | v266.5,39 266.5,33.25 264.5,33.25 263.75,32.5 263.75,29.75 264.25,29.25 v264.75,29.25 | v292.25,30.5 292,30.75 v283.25,30.75 | v266.5,64.5 313.75,64.5 314.25,65 v314.25,67.5
  Bottom 0.406: v11.11,74.52 7.3,74.52 6.03,73.25 v6.03,12.29 | v11.11,12.29 11.11,18.64 12.38,19.91 v20,19.91
  Bottom 0.813: CON1.+ 17.5,5.94 26.35,5.94 J8.6 27.62,8.48 20,16.1 v20,19.91 20,35.15 21.27,36.42 27.62,36.42 28.89,37.69 28.89,73.25 32.22,76.58 67.47,76.58 68.26,75.79 v68.26,69.44 | J4.6 94.75,17.45 87.83,17.45 v87.02,16.64 | CON2.+ 68.49,5.75 73.5,5.75 75.5,3.75 79.75,3.75 83.21,7.21 JP119.P$1
  Bottom 1.016: CON2.+ 46.67,8.48 v42.86,12.29 | v21.41,12.29 16.19,12.29 14.96,11.06 CON1.+
  Bottom 1.27: v316.75,19.75 v316.75,41 316.75,65 v314.25,67.5 314.25,76.5 313.5,77.25 150.5,77.25 139.25,66 139.25,20.5 136.7,17.95 J5.6 108.5,26.5 110,28 120.75,28 121.5,28.75 121.5,40.25 123.5,42.25 v135.75,42.25
CHG
  Top 0.254: Q8.2 36.51,35.2 36.51,36.42 39.05,38.96 39.05,42.77 39.31,43.03 U1.2
CLK
  Top 1.016: JP96.1 JP77.1 JP58.1
CMD
  Top 1.016: JP18.1 JP37.1 JP56.1
DSG
  Top 0.254: Q9.1 50.18,15.13 48.89,16.42 R34.1 48.89,22.77 47.94,23.72 45.4,23.72 44.13,24.99 44.13,30.07 42.86,31.34 41.59,31.34 40.32,32.61 40.32,41.98 U1.1
EN
  Top 1.016: JP2.1 JP21.1 JP40.1
G0
  Top 1.016: JP101.1 JP82.1 JP63.1
G2  (via drill 0.35)
  Top 0.152: R30.2 14.15,17.6 14.55,18 32.5,18 34,19.5 34,23.5 32.75,24.75 v32.75,28 | v34,31.25 40.5,31.25 v42.75,29 | v46.25,29 48.75,29 49,28.75 v64.5,28.75 | v69.25,28.75 v77.25,28.75
  Top 1.016: JP100.1 JP81.1 JP62.1
  Bottom 0.152: v34,31.25 32.75,30 v32.75,28 | v42.75,29 v46.25,29 | v64.5,28.75 v69.25,28.75 | v77.25,28.75 79,28.75 79.25,29 79.25,37.25 79.69,37.69 JP100.1
G4  (via drill 0.25)
  Top 0.152: JP64.1 94.52,42.77 95.25,43.5 J2.1 | R43.2 v305,18.25 | v310.75,29.25 v310.75,55 | v310.75,59 v231,59 | v231,54.75 R44.2 | J3.1 v113.5,45 | v137.5,45.75 141,45.75 142.5,44.25 v146,44.25 | v149.5,44.25 175.5,44.25 175.75,44 175.75,43.25 176,43 225.5,43 225.75,43.25 v225.75,50.75
  Top 1.016: JP102.1 JP83.1 JP64.1
  Bottom 0.152: J3.1 J2.1 | v305,18.25 310.25,18.25 310.75,18.75 v310.75,29.25 | v310.75,55 v310.75,59 | v231,59 v231,54.75 226,54.75 225.75,54.5 v225.75,50.75 | v113.5,45 114.5,45 115.25,45.75 v137.5,45.75 | v146,44.25 v149.5,44.25
G5  (via drill 0.25)
  Top 0.152: JP67.1 93.36,50.39 93.75,50 93.75,47.75 94,47.5 95.21,47.5 J2.2 | R55.2 v231,18 | v237.25,19 248.25,19 v249.5,20.25 | R56.2 248.3,53.2 v248.25,53.25 | v257.25,40.75 246.25,40.75 245.75,40.25 245.75,39 245.5,38.75 244,38.75 243.75,39 243.75,40.5 243.25,41 v242,41 | v239,41 227.25,41 227,41.25 v227,42.5 | v225.5,42.25 225.25,42.5 175.75,42.5 175.25,43 175.25,43.5 175,43.75 150,43.75 v149.5,43.25 | v146,43.25 145.75,43.25 145.25,43.75 142.25,43.75 140.75,45.25 138,45.25 v137.5,44.75 | v112.75,45.75 112.75,47.25 112.46,47.54 J3.2
  Top 1.016: JP105.1 JP86.1 JP67.1
  Bottom 0.152: J3.2 J2.2 | v231,18 236.25,18 v237.25,19 | v249.5,20.25 249.5,27.25 250.75,28.5 256.5,28.5 257.25,29.25 v257.25,40.75 257.25,53 257,53.25 v251.25,53.25 v248.25,53.25 | v242,41 v239,41 | v227,42.5 225.75,42.5 v225.5,42.25 | v149.5,43.25 v146,43.25 | v137.5,44.75 137.25,44.75 136.75,45.25 119.25,45.25 119,45 119,43.75 118.5,43.25 116.75,43.25 115.75,44.25 113,44.25 112.75,44.5 v112.75,45.75
G12  (via drill 0.25, 0.35)
  Top 0.152: JP51.1 58.48,42.77 v59,42.25 | v91,44 93.25,44 93.75,44.5 93.75,46 94,46.25 96,46.25 96.5,46.75 96.5,49.75 96.17,50.08 J2.3 | R67.2 v249.5,18.25 | v261,48.25 v264,48.25 | v266.75,53.25 267.95,53.25 R68.2 | v176.5,11 v171.5,11 | v167.5,11 v157.75,11 | v144.75,13.75 144.75,23.5 144.5,23.75 142.75,23.75 141.5,25 v129,25 | v110,22.75 v103,22.75 | J3.3 106.75,50.08 106.25,49.58 v106.25,44.25
  Top 1.016: JP13.1 JP32.1 JP51.1
  Bottom 0.152: v59,42.25 78.75,42.25 79.25,42.75 79.25,43.75 79.5,44 v91,44 | J2.3 J3.3 | v264,48.25 263.5,48.75 263.5,52.75 264,53.25 v266.75,53.25 | v261,48.25 261,41.25 260.5,40.75 258.25,40.75 257.75,40.25 257.75,18.75 257.25,18.25 v249.5,18.25 246.25,18.25 246,18 246,14.5 245.75,14.25 227,14.25 226.75,14 226.75,13.5 226.5,13.25 225.25,13.25 225,13.5 182.5,13.5 182.25,13.25 182.25,12.5 181.25,11.5 176.75,11.5 176.5,11.25 v176.5,11 | v171.5,11 v167.5,11 | v157.75,11 146,11 144.75,12.25 v144.75,13.75 | v110,22.75 124,22.75 124.25,23 124.25,24.75 124.5,25 v129,25 | v103,22.75 103.5,23.25 103.5,25.75 104.5,26.75 104.5,35.5 106.25,37.25 v106.25,44.25
G13  (via drill 0.25, 0.35)
  Top 0.152: JP53.1 58.44,37.69 v59,38.25 | R79.2 v268,18 | v278,19 278,19.5 278.5,20 284.75,20 v285,19.75 | R80.2 v286.5,54.5 | v268,19.75 v251.75,19.75 | v245.25,19.75 v184.25,19.75 | v180.25,18.75 180.25,20 180,20.25 v179.75,20.25 | v142.75,20.5 142.75,23 141.75,24 v129,24 | v125,24 v116.75,24 | v110,23.75 v102.75,23.75 | v105.25,44.25 105.25,52 105.87,52.62 J3.4
  Top 1.016: JP15.1 JP34.1 JP53.1
  Bottom 0.152: v59,38.25 78.75,38.25 79.5,39 91.25,39 91.75,39.5 91.75,51.75 92.62,52.62 J2.4 J3.4 | v278,19 278,18.5 277.5,18 v268,18 v268,19.75 | v285,19.75 293,19.75 293.5,20.25 293.5,30.25 293.75,30.5 293.75,31.75 293.5,32 293.5,53 293.25,53.25 286.75,53.25 286.5,53.5 v286.5,54.5 | v251.75,19.75 251.5,19.75 250.75,19 245.5,19 245.25,19.25 v245.25,19.75 | v184.25,19.75 183,19.75 182.25,19 180.5,19 v180.25,18.75 | v179.75,20.25 143,20.25 v142.75,20.5 | v129,24 v125,24 | v116.75,24 110.25,24 v110,23.75 | v102.75,23.75 102.75,26 103.75,27 103.75,35.75 105.25,37.25 v105.25,44.25
G14  (via drill 0.25, 0.35)
  Top 0.152: J2.5 94.25,55.16 93.75,54.66 v93.75,51.25 | v93.7,46.95 91.03,46.95 v90.89,46.8 | v299,20.25 287.25,20.25 286.5,19.5 R91.2 285.75,17.45 285.75,20 285.25,20.5 250.75,20.5 v250.5,20.25 | v298.5,38.25 v302,38.25 | v302.5,53.25 302.55,53.2 R92.2 | v248.5,20.25 248.25,20.5 182.75,20.5 v182.5,20.25 | v110,21.75 v102.75,21.75 | J3.5 108.41,55.25 105,55.25 104.25,54.5 v104.25,44.25 | v141.75,20.5 141.75,22.5 141.5,22.75 v137.75,22.75
  Top 1.016: JP12.1 JP31.1 JP50.1
  Bottom 0.152: JP50.1 79.06,45.31 79.25,45.5 79.25,46.25 79.5,46.5 80.46,46.5 80.47,46.5 90.59,46.5 v90.89,46.8 | v93.75,51.25 93.7,51.2 v93.7,46.95 | J2.5 J3.5 | v299,20.25 299,37.75 v298.5,38.25 | v302,38.25 302,52.75 v302.5,53.25 | v250.5,20.25 250.5,19.75 250.25,19.5 248.75,19.5 248.5,19.75 v248.5,20.25 | v182.5,20.25 182.5,20 182,19.5 142.75,19.5 v141.75,20.5 | v137.75,22.75 137.75,21.5 136.5,20.25 110.5,20.25 110,20.75 v110,21.75 | v102.75,21.75 102.25,21.75 102,22 102,26.25 103,27.25 103,36 104.25,37.25 v104.25,44.25
G15  (via drill 0.25, 0.35)
  Top 0.152: JP61.1 92.15,35.15 92.5,35.5 v92.5,41.75 | v92.5,51.5 93.25,52.25 93.25,57 93.95,57.7 J2.6 | R41.2 304.55,72 300,72 v299.75,71.75 | v282,67.75 281.25,67 274.25,67 273.75,66.5 273.75,60.5 272.75,59.5 232,59.5 231.75,59.75 230.25,59.75 230,59.5 v230,59 | R42.2 v231,37.5 | J3.6 113.45,57.7 v113.5,57.75 | v225.5,37.5 158.75,37.5 158,38.25 158,42.25 157.25,43 v150.5,43 | v141,50.5 137.5,50.5 137,51 v137,54.75
  Top 1.016: JP99.1 JP80.1 JP61.1
  Bottom 0.152: v92.5,41.75 v92.5,51.5 | J2.6 J3.6 | v299.75,71.75 298.75,70.75 281.75,70.75 281.5,70.5 281.5,68.25 v282,67.75 | v230,59 230,59.5 230.25,59.75 231.5,59.75 232.25,59 233.5,59 233.75,58.75 233.75,51 233.25,50.5 232.25,50.5 232,50.25 232,38 231.5,37.5 v231,37.5 v225.5,37.5 | v113.5,57.75 114.75,59 136,59 137,58 v137,54.75 | v150.5,43 150.5,44.75 150,45.25 146.5,45.25 146,45.75 146,49.75 145.25,50.5 v141,50.5
G16  (via drill 0.25, 0.35)
  Top 0.152: v91,51 92.75,52.75 92.75,59.5 93.5,60.25 J2.7 | JP65.1 89.56,45.31 90,45.75 90,47.5 90.25,47.75 90.75,47.75 91,48 v91,49.75 | R54.2 v249.5,37.25 | v247.5,60.25 232,60.25 231.75,60.5 231.75,61.25 231.5,61.5 226.5,61.5 v226,62 | v226.75,72.5 230.95,72.5 R53.2 | v226,70 v226,62 | v226,62 201.5,62 201,61.5 v171.5,61.5 | v124.25,60.25 124.25,53.5 v124.75,53 | v138,52.5 141.5,52.5 142.25,53.25 v142.25,57.5 | v165.75,62.5 167.25,62.5 167.5,62.25 v167.5,61.5
  Top 1.016: JP103.1 JP84.1 JP65.1
  Bottom 0.152: v91,49.75 v91,51 | J2.7 J3.7 v124.24,60.24 v124.25,60.25 | v249.5,37.25 249.5,50 249.75,50.25 251.75,50.25 252,50.5 252,51.75 251.75,52 248,52 247.5,52.5 v247.5,60.25 | v226,70 226,71.75 v226.75,72.5 | v171.5,61.5 v167.5,61.5 | v124.75,53 136.25,53 136.75,52.5 v138,52.5 | v142.25,57.5 142.25,63 142.5,63.25 165,63.25 v165.75,62.5
G17  (via drill 0.25, 0.35)
  Top 0.152: JP66.1 87.94,49.75 v90,49.75 | v90,51 92.25,53.25 92.25,62 93.03,62.78 J2.8 | v248,65 247.5,65.5 v247.5,69.25 | R66.2 v268,37.5 | v245.5,69.25 245,69.25 244.75,69.5 244.75,72 245.2,72.45 R65.2 v249.5,73.75 | v176.75,67.75 v172.5,67.75 | v141,53.75 v138,53.75 | v125.25,57 125.25,62.25 124.75,62.75 v116.75,62.75 | v167.5,64.5 157.75,64.5 157.5,64.25 v146.25,64.25
  Top 1.016: JP104.1 JP85.1 JP66.1
  Bottom 0.152: v90,49.75 v90,51 | J2.8 J3.8 108.53,62.75 v116.75,62.75 | v268,37.5 268,40 268,49.75 268.5,50.25 270.25,50.25 270.5,50.5 270.5,62.75 270.25,63 248.25,63 248,63.25 v248,65 | v247.5,69.25 v245.5,69.25 | v249.5,73.75 249.5,74.75 249.25,75 179,75 178.5,74.5 178.5,68.25 178,67.75 v176.75,67.75 | v167.5,64.5 172,64.5 172.5,65 v172.5,67.75 | v146.25,64.25 141.5,64.25 141,63.75 v141,53.75 | v138,53.75 125.5,53.75 125.25,54 v125.25,57
G18  (via drill 0.25)
  Top 0.152: JP68.1 86.11,53 91.25,53 91.75,53.5 91.75,64.75 92.32,65.32 J2.9 | R78.2 v286.5,37.5 | v286.5,39 v286.5,41.75 | v285,52 v285,55 | v285,61.25 284,60.25 274.75,60.25 v274.5,60 | v263,64.5 263,67 263.5,67.5 264.5,67.5 264.75,67.75 v264.75,68.25 | v263,69 263,72.25 263.25,72.5 267.95,72.5 R77.2 v268,74 | v176.75,68.75 v171.5,68.75 | v167.5,66.75 165.25,66.75 164,68 146,68 145.25,67.25 145.25,62 139.25,56 v138,56
  Top 1.016: JP106.1 JP87.1 JP68.1
  Bottom 0.152: J2.9 J3.9 136.68,65.32 138,64 v138,56 | v286.5,37.5 v286.5,39 | v285,52 285.75,52 286.5,51.25 v286.5,41.75 | v285,55 v285,61.25 | v263,64.5 263.75,63.75 274,63.75 274.5,63.25 v274.5,60 | v264.75,68.25 263.25,68.25 263,68.5 v263,69 | v268,74 268,75.25 267.75,75.5 178.5,75.5 178,75 178,69.25 177.5,68.75 v176.75,68.75 | v171.5,68.75 171.5,67.5 170.75,66.75 v167.5,66.75
G19  (via drill 0.25)
  Top 0.152: JP69.1 90.72,55.47 91.25,56 91.25,67.25 91.86,67.86 J2.10 | R90.2 v305,41.75 | v303.5,63.75 303.25,64 v303.25,69.75 | R89.2 285.05,72.45 v285,72.5 | v176.75,69.75 v171.5,69.75 | v167.5,67.75 v165.5,67.75 | v147.5,72.25 v143.5,72.25
  Top 1.016: JP107.1 JP88.1 JP69.1
  Bottom 0.152: J2.10 J3.10 110.36,67.86 110.75,68.25 110.75,71.75 111.25,72.25 131.75,72.25 132.25,71.75 132.25,69.5 132.75,69 138.75,69 139.25,69.5 139.25,71.75 139.75,72.25 v143.5,72.25 | v305,41.75 305,63.5 304.75,63.75 v303.5,63.75 | v303.25,69.75 303.25,72 302.75,72.5 v288.25,72.5 v285,72.5 285,75.5 284.5,76 177.25,76 176.75,75.5 v176.75,69.75 | v171.5,69.75 168,69.75 167.5,69.25 v167.5,67.75 | v165.5,67.75 165.5,72.25 164.5,73.25 150,73.25 149,72.25 v147.5,72.25
G23
  Top 1.016: JP113.1 JP94.1 JP75.1
G25
  Top 0.152: S2.4 S2.3 39.69,64.5 R38.1 39.37,62 47,62 47.5,61.5 47.5,53.25 47.82,52.93 JP9.1
  Top 1.016: JP9.1 JP28.1 JP47.1
G26  (via drill 0.25)
  Top 0.254: R93.2 175.95,6.3 175.75,6.5 v175.75,9.25 | v181.25,13.25 v181.25,20.25 | v181.25,29.25 v181.25,30.75 | v181.25,52.5 178.75,52.5 178.5,52.75 178.5,54.25 178.25,54.5 177.3,54.5 R98.2 175.3,54.45 v175.25,54.5 | v148.25,73 v144.25,73
  Top 1.016: JP10.1 JP29.1 JP48.1
  Bottom 0.152: JP48.1 78.89,50.39 80.08,51.58 86.5,51.58 86.92,52 91,52 92.25,53.25 93.25,53.25 94,54 94,70 94.4,70.4 J2.11 J3.11
  Bottom 0.254: v175.75,9.25 175.75,11.75 176,12 180.75,12 181.25,12.5 v181.25,13.25 | v181.25,20.25 v181.25,29.25 | v181.25,30.75 v181.25,52.5 | v148.25,73 149.25,74 174.5,74 175.25,73.25 v175.25,54.5 | v144.25,73 110.5,73 109.75,72.25 109.75,70.75 109.4,70.4 J3.11
G27  (via drill 0.25, 0.35)
  Top 0.152: JP49.1 57.1,47.85 57.5,48.25 57.5,51 57.75,51.25 v59.75,51.25
  Top 0.254: v176,31.25 176,25.8 176.5,25.3 R108.2 | R103.2 177.45,73 v176,73 176,72.5 175.5,72 167.75,72 167.25,72.5 v167.25,73 | v165.75,73 164.75,74 v145,74
  Top 1.016: JP11.1 JP30.1 JP49.1
  Bottom 0.152: v59.75,51.25 78.5,51.25 79.5,52.25 79.5,53.5 80.12,54.12 92.62,54.12 93.5,55 93.5,72.5 94,73 95.19,73 J2.12 J3.12
  Bottom 0.254: v176,31.25 v176,73 | v167.25,73 v165.75,73 | J3.12 108.5,73.5 109,74 v145,74
G32
  Top 0.152: R113.1 59.31,64.94 59.31,60.42 59.3,60.42 C2.1 57.8,60.25 JP45.1
  Top 1.016: JP7.1 JP26.1 JP45.1
G33
  Top 0.152: R114.2 63.25,56.75 62.75,57.25 60,57.25 59.5,56.75 59.5,55.05 C27.1 56.03,55 JP46.1
  Top 1.016: JP8.1 JP27.1 JP46.1
G34  (via drill 0.35)
  Top 0.152: R1.1 JP43.1 | U1.20 34.83,42.36 v33.72,41.25 | v44.13,63.09 JP5.1
  Top 1.016: JP5.1 JP24.1 JP43.1
  Bottom 0.152: v33.72,41.25 32.7,42.27 32.7,61.82 33.97,63.09 v44.13,63.09
G35
  Top 1.016: JP6.1 JP25.1 JP44.1
GND  (via drill 0.25, 0.35, 0.8, 1)
  Top 0.152: C17.2 24.13,30.54 R15.1 24.13,29.6 C18.1 23.81,25.94 23.81,24.99 26.35,22.45 27.62,22.45 28.89,21.18 28.89,19.64 29.66,18.87 31.93,18.87 32.7,19.64 v32.7,19.91 | R32.1 35.24,16.1 36.51,17.37 R31.1 | C21.2 41.17,24.57 v40.32,23.72 | R1.2 60.22,58.93 60.89,58.26 v61.93,58.26 | JP108.1 v77.15,58.01 v74.61,58.01 | JP52.1 58.1,40.23 60.5,42.63 60.5,56.08 60.91,56.49 v61.91,56.49 61.91,55.46 C27.2 | JP108.1 80.96,57.51 80.19,56.74 v77.15,56.74 v74.61,56.74 | C19.1 34.39,24.57 v35.24,23.72 | v37.78,23.72 37.78,14.83 36.51,13.56 32.7,13.56 32.18,14.08 20.52,14.08 19.96,13.52 CON1.- 20,8.44 20,5.94 18.73,4.67 J1.1 | v69.5,60.25 70.5,60.25 72,58.75 80.22,58.75 JP108.1 | v64.5,60.25 64.5,61 64.25,61.25 61.25,61.25 61.2,61.2 C2.2 | IC3.2 300.75,14.51 300.75,12.75 300.5,12.5 292.5,12.5 292.25,12.75 292.25,14 291.75,14.5 288.5,14.5 v288.25,14.75 | v282.5,13.5 282.5,14.76 IC19.2 282.12,14.88 281.75,14.5 281.75,13 281.25,12.5 278,12.5 277.75,12.25 v274.75,12.25 | v248,16.25 245.75,16.25 245.62,16.11 IC11.2 245.62,14.75 245,14.75 244.75,14.5 244.75,12.75 244.5,12.5 237,12.5 236.75,12.75 236.75,18.5 236.25,19 227.5,19 226.87,18.36 IC7.2 226.62,14.88 v225.75,14 | v251.25,16.25 255,16.25 255.25,16 255.25,12.75 255.5,12.5 263.75,12.5 264.12,12.86 IC15.2 264.12,15.86 264.25,16 v266.5,16 | C28.2 117.75,71.7 v117.75,75 | C8.2 118.95,11.25 117.25,11.25 116.75,11.75 v116.75,19.25 | v113.75,19.25 113.75,24 113.25,24.5 v95.75,24.5 | v93.75,26.5 88,26.5 87.5,26 v79.5,26 | v77.25,37.5 77.25,54 77.5,54.25 78.37,54.25 v78.42,54.2 | IC11.3 245.62,9.89 v245.5,10 | v255.25,10 255.25,10.5 255.5,10.75 v263.75,10.75
  Top 0.152: v279.25,19 282.75,19 283,18.75 283,16.25 283.25,16 284.75,16 v285,15.75 | v299,19 v314.5,19 | v248,29.25 246.5,29.25 245.62,28.36 IC6.3 245.62,29.11 246,29.5 246,32.25 244.75,33.5 244.75,37 v245.25,37.5 | v301.5,29.75 301.25,30 292.5,30 292.25,29.75 v292.25,29.5 | IC8.3 244.88,45.12 244.75,45 v244.75,39.5 | IC18.2 301.5,33.74 v301.5,32.75 | v293,31.25 293.25,31.5 v302,31.5 | v282.5,35.5 282.62,35.39 IC14.2 | v282.5,29.25 281.5,29.25 280.75,30 274.25,30 273.75,29.5 v273.75,25.5 | v282.5,50 282.5,51.26 IC16.2 282.49,51.25 281.75,51.25 281.25,50.75 281.25,49.25 281,49 274.25,49 273.75,49.5 273.75,51 273.5,51.25 v269.75,51.25 | v255.25,29.25 255.25,29.5 255.75,30 262.25,30 262.5,29.75 262.5,25.75 262.75,25.5 v263.75,25.5 | IC10.2 264.12,32.36 263.5,31.75 v256.25,31.75 | IC6.2 245.62,33.14 245.75,33 247.25,33 247.5,32.75 v247.5,31.75 | v245.25,32 243.5,32 243.25,32.25 237.25,32.25 235.5,34 234.5,34 234.25,34.25 234.25,38.25 234,38.5 227.25,38.5 227.12,38.37 IC2.2 227.12,33.14 227.25,33 229,33 229.25,32.75 229.25,27.5 v229.5,27.25 | 184.75,25.5 IC24.3 | IC20.2 301,51.26 301,49.5 300.5,49 292.75,49 292.25,49.5 292.25,51.25 292,51.5 v288.25,51.5 | 182.5,55.25 182.75,55.5 188.75,55.5 189,55.25 189,54 189.25,53.75 191.5,53.75 192,53.25 192,51.25 192.25,51 213.75,51 214,51.25 214,52.25 214.5,52.75 220.5,52.75 220.75,53 225.5,53 225.75,52.75 225.75,51.75 226,51.5 226.99,51.5 IC4.2 227.12,50.13 v227.25,50 | IC1.2 301.12,68.86 300.75,68.5 292.75,68.5 292.25,69 292.25,71.25 292,71.5 v288.25,71.5 | IC12.2 264.12,50.13 v264.25,50 264.25,49.25 264,49 255.5,49 255.25,49.25 255.25,51 255,51.25 v251.25,51.25
  Top 0.152: IC8.2 245.62,50.13 v245.75,50 245.75,49.25 245.62,49.12 236.88,49.12 236.75,49.25 236.75,50.75 236.25,51.25 v232.75,51.25 | v285,71.5 284.75,71.75 282.75,71.75 282.62,71.61 IC17.2 281.38,70.62 281.25,70.5 281.25,68.75 280.75,68.25 274,68.25 273.75,68.5 273.75,71.25 273.5,71.5 v269.75,71.5 | v266.75,71.5 266.5,71.5 266.25,71.75 264.25,71.75 264.12,71.61 IC13.2 264.12,68.36 264,68.25 255.5,68.25 255.25,68.5 255.25,71.25 255,71.5 v251.25,71.5 | v248.25,71.5 248,71.75 245.75,71.75 245.62,71.61 IC9.2 245.87,70.62 246.12,70.38 246.12,68.61 245.75,68.25 237,68.25 236.75,68.5 236.75,71.25 236.5,71.5 v232.75,71.5 | v229.75,71.5 229.5,71.75 227.25,71.75 227.12,71.61 IC5.2 226.99,70.75 226.5,70.75 226.25,71 226.25,71.75 226,72 221,72 220.75,71.75 220.75,70 220.5,69.75 193,69.75 192.75,70 192.75,71.75 192.5,72 189.5,72 189.25,71.75 189.25,71.5 189,71.25 v186.5,71.25 | IC9.3 245.75,64.51 v245.75,65.75 | v310.75,65.75 v310.75,63.75 | v314.5,47.75 Q41.D
  Top 0.254: C25.2 C24.2 45.08,53.25 v44.13,54.2 | C25.2 43.45,43.69 U1.3 38.69,43.69 37.78,42.77 37.78,38.96 35.51,36.69 Q8.1 | JP14.1 46.67,40.23 45.08,41.82 C25.2 | C23.2 42.86,56.74 44.13,55.47 v44.13,54.2 | C22.2 v44.13,54.2 | PS1.2 155.64,22.46 C5.1 | C59.1 167.39,32.96 PS8.2 157.29,32.96 v157.25,33 | IC27.1 154.71,37.21 155,37.5 C30.2 | IC27.1 143.29,37.21 143,37.5 C29.2 | JP116.P$1 152.85,32.9 IC27.1 | 154.12,47.38 154.5,47.75 157,47.75 157.25,48 157.25,55.75 156.85,56.15 C53.1 155.61,56.29 PS7.2 147,59.75 147.5,60.25 165.75,60.25 v166.5,61 | 154.12,47.38 JP118.P$1 | 154.12,47.38 154.25,47.25 157.5,47.25 157.75,47.5 157.75,55.75 158.46,56.46 PS2.2 164.5,53.25 164.9,52.85 C10.1 168.1,52.75 169.5,52.75 169.75,53 169.75,55.5 170,55.75 182,55.75 182.5,55.25 182.48,55.23 IC22.3 182.48,53.02 182.75,52.75 v183.75,52.75 | C29.2 116.3,38.8 116,38.5 116,11.75 117.05,10.7 C8.2 120.45,11.66 IC25.5 123.84,11.66 124.25,11.25 JP130.1 | C29.2 144.45,38.8 v144.5,38.75 | v140.75,40 140.25,40 140,40.25 115.25,40.25 114.5,41 114.5,68.25 116.2,69.95 C28.2 120.45,70.91 IC26.5 119.25,73.19 JP132.1 | v166.5,72.25 166.5,73.75 166.88,74.12 182.38,74.12 182.75,73.75 182.73,73.73 IC23.3 182.75,72.73 v182.75,71.25 | IC21.3 185.02,11.48 184.75,11.75 171.75,11.75 171.5,12 v171.5,12.5 | v167.5,12.5 157.25,12.5 157,12.25 157,11 156.5,10.5 150.25,10.5 149.75,11 v149.75,22 149.75,24 149.25,24.5 143,24.5 142.5,25 142.5,26 142.25,26.25 v129,26.25 | v125,26.25 117.5,26.25 117.25,26.5 v117.25,29.25 | v111.75,29.25 v111.75,25.75 | v183.75,27.25 183.75,26 184.25,25.5 184.75,25.5
  Top 0.406: Q5.2 10.94,15.78 12.38,14.34 12.38,7.21 13.65,5.94 17.42,5.94 CON1.-
  Top 0.813: CON1.- 37.78,8.48 40.32,5.94 J8.1 | v73.59,13.06 78.92,13.06 79.69,12.29 79.69,5.94 v82.23,3.4 | J5.1 J4.1 | JP122.P$1 77.31,10.19 75.75,11.75 72.25,11.75 71.75,12.25 71.75,13.75 72.25,14.25 87.75,14.25 88.75,15.25 v88.75,19.5
  Top 1.016: R32.1 20,16.1 18.73,14.83 18.73,9.71 CON1.- 21.23,9.75 40.32,9.75 42.86,7.21 v42.86,6.44 | v63.18,11.02 v63.18,5.94 | JP14.1 JP33.1 JP52.1 | JP114.1 JP95.1 JP76.1 | JP108.1 JP89.1 JP70.1 | JP120.P$1 78.42,23.81 v78.42,54.2
  Top 1.27: JP136.P$1 JP135.P$1 95.25,26 v88.75,19.5 | JP125.1 JP131.1 112.5,37.75 JP136.P$1 | Q43.D v314.5,39.5 Q41.D | v141.5,27.75 v137,27.75 | v111.75,25.75 v105.75,25.75 105.75,35 JP136.P$1
  Bottom 0.152: v40.32,23.72 v37.78,23.72 v35.24,23.72 | v61.93,58.26 74.36,58.26 v74.61,58.01 | v61.91,56.49 74.36,56.49 v74.61,56.74 | v69.5,60.25 69.25,60 64.75,60 v64.5,60.25 | v282.5,13.5 287,13.5 v288.25,14.75 | v248,16.25 v251.25,16.25 | v266.5,16 273.75,16 274,15.75 274,12.75 274.5,12.25 v274.75,12.25 | v225.75,14 179.75,14 179.5,13.75 179.5,12.75 179.25,12.5 v171.5,12.5 | v117.75,75 117.25,75.5 103,75.5 102.25,74.75 101.25,74.75 100.5,75.5 86.25,75.5 86,75.25 86,73.29 JP76.1 | v116.75,19.25 v113.75,19.25 | v95.75,24.5 v93.75,26.5 | v79.5,26 76.75,26 76.5,26.25 76.5,36.75 v77.25,37.5 | v245.5,10 v255.25,10 | v263.75,10.75 278.5,10.75 278.75,11 278.75,18.5 v279.25,19 | v285,15.75 298.5,15.75 299,16.25 v299,19 | v248,29.25 v255.25,29.25 | v301.5,29.75 302,30.25 v314.5,30.25 | v244.75,39.5 245,39.25 245,37.75 v245.25,37.5 | v301.5,32.75 302,32.25 v302,31.5 | v293,31.25 283.75,31.25 283.25,31.75 283.25,35.25 283,35.5 v282.5,35.5 v282.5,50 282.5,52.25 283,52.75 287.75,52.75 288.25,52.25 v288.25,51.5 | v292.25,29.5 292,29.25 v282.5,29.25 | v273.75,25.5 v263.75,25.5 | v256.25,31.75 v247.5,31.75 245.5,31.75 v245.25,32 | v229.5,27.25 229.5,24.5 229,24 184.25,24 183.75,24.5 v183.75,27.25 | v264.25,50 264.25,51 264.5,51.25 v269.75,51.25 | v251.25,51.25 246,51.25 245.75,51 v245.75,50 | v232.75,51.25 227.5,51.25 227.25,51 v227.25,50 | v288.25,71.5 v285,71.5 | v269.75,71.5 v266.75,71.5 | v251.25,71.5 v248.25,71.5 | v232.75,71.5 v229.75,71.5 | v186.5,71.25 v182.75,71.25 | v245.75,65.75 v310.75,65.75 | v314.5,47.75 314.5,63 313.75,63.75 v310.75,63.75
  Bottom 0.254: PS1.2 153.71,22.46 154,22.75 JP116.P$1 | JP116.P$1 154,32.75 154.25,33 v157.25,33 | JP116.P$1 154.5,32.25 154.5,46.75 JP118.P$1 | v144.5,38.75 144.5,39.75 144.25,40 v140.75,40 | v166.5,72.25 v166.5,61 | v171.5,12.5 v167.5,12.5 | v129,26.25 v125,26.25 | v117.25,29.25 v111.75,29.25 | v183.75,27.25 v183.75,30 | v183.75,30 v183.75,52.75 183,52.75 182.75,53 v182.75,71.25 | v149.75,22 150.5,21.25 157.25,21.25 157.75,21.75 157.75,29.75 158.25,30.25 168.25,30.25 168.5,30 v183.75,30
  Bottom 0.813: J8.1 40.32,12.29 v32.7,19.91 44.13,19.91 46.67,17.37 59.37,17.37 63.68,13.06 v73.59,13.06 | v82.23,3.4 89.85,3.4 91.7,5.25 J4.1 | v63.18,11.02 76.23,11.02 77.31,9.94 JP122.P$1 | v88.75,19.5 88.25,19 84,19 80.3,22.7 JP120.P$1
  Bottom 1.016: v63.18,5.94 43.36,5.94 v42.86,6.44 | 79.69,58.01 78.42,56.74 v78.42,54.2 | JP108.1 79.69,58.01 | 79.69,58.01 78.42,59.28 78.42,71.98 79.69,73.25 JP114.1
  Bottom 1.27: JP116.P$1 148.75,31.75 147.25,30.25 147.25,28.5 146.5,27.75 v141.5,27.75 | v137,27.75 124.25,27.75 122.25,25.75 v111.75,25.75 | v105.75,25.75 104.5,24.5 104.5,6 105.25,5.25 J5.1 125.5,5.25 129,1.75 311.75,1.75 314.5,4.5 314.5,16 v314.5,19 v314.5,30.25 v314.5,39.5
IN+
  Top 0.152: C7.1 222,5.85
  Top 0.254: 222,5.85 218.45,5.85 D8.1 211.55,6.05 Q49.D